# EAGLE schematic Open Lamborghino (EAGLE 9.6.2)
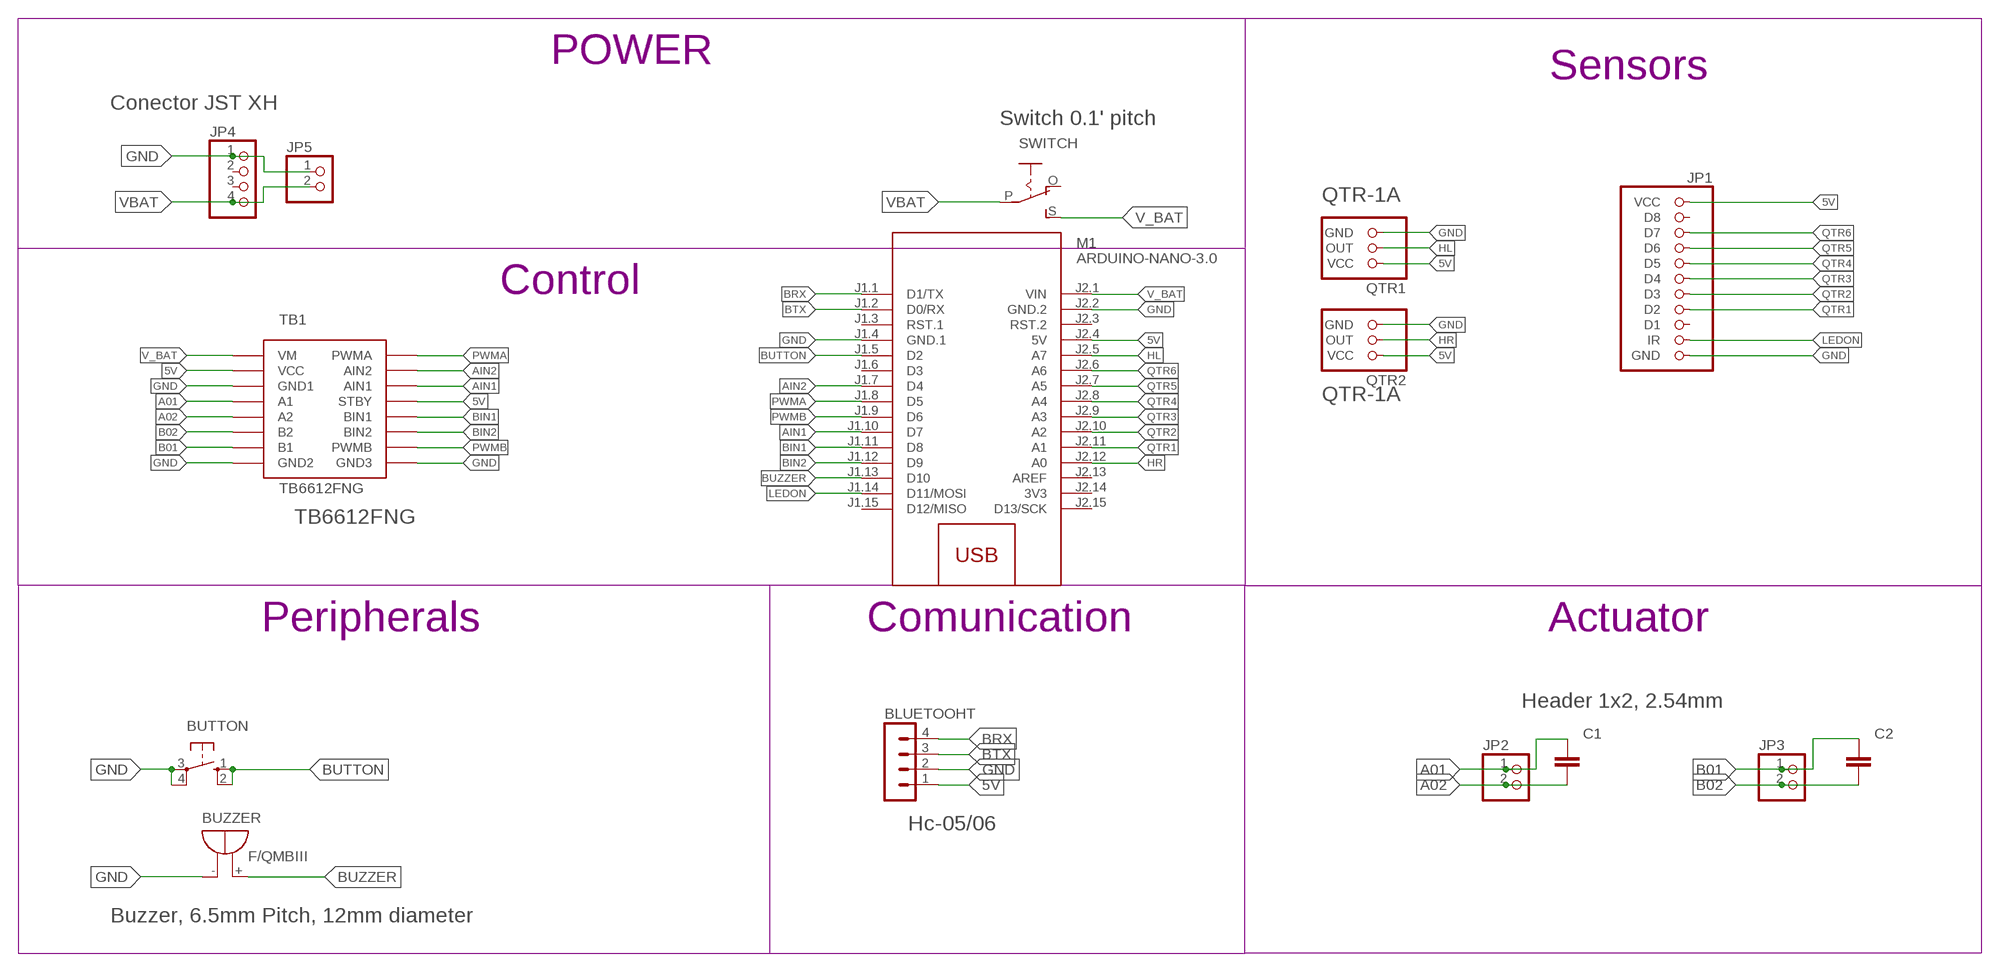
[diagram p0: schematic, sheet 1]

## Parts
BLUETOOHT  MA04-1  [MA04-1]
BUTTON  10-XX  [B3F-10XX]
BUZZER  F/QMBIII  [F/QMBIII]
C1  C_CHIP-1206(3216-METRIC)  [CAPC3216X135]
C2  C_CHIP-1206(3216-METRIC)  [CAPC3216X135]
JP1  QTR8A(CHINO)  [1X11]
JP2  PINHD-1X2  [1X02]
JP3  PINHD-1X2  [1X02]
JP4  PINHD-1X4  [1X04]
JP5  PINHD-1X2  [1X02]
M1  ARDUINO-NANO-3.0  [ARDUINO-NANO-3.0]
QTR1  QTR1(CHINO)  [QTR1]
QTR2  QTR1(CHINO)  [QTR1]
SWITCH  EG1218S  [EG1218]
TB1  TB6612FNG  [TB6612FNG]

## Nets
5V: BLUETOOHT.1 JP1.1(VCC) M1.J2.4(5V) QTR1.1(VCC) QTR2.1(VCC) TB1.STBY TB1.VCC
A01: C1.1 JP2.1 TB1.A1
A02: C1.2 JP2.2 TB1.A2
AIN1: M1.J1.10(D7) TB1.AIN1
AIN2: M1.J1.7(D4) TB1.AIN2
B01: C2.1 JP3.1 TB1.B1
B02: C2.2 JP3.2 TB1.B2
BIN1: M1.J1.11(D8) TB1.BIN1
BIN2: M1.J1.12(D9) TB1.BIN2
BRX: BLUETOOHT.4 M1.J1.1(D1/TX)
BTX: BLUETOOHT.3 M1.J1.2(D0/RX)
BUTTON: BUTTON.1(S) BUTTON.2(S1) M1.J1.5(D2)
BUZZER: BUZZER.+(-) M1.J1.13(D10)
GND: BLUETOOHT.2 BUTTON.3(P) BUTTON.4(P1) BUZZER.-(+) JP1.11(GND) JP4.1 JP5.1 M1.J1.4(GND.1) M1.J2.2(GND.2) QTR1.3(GND) QTR2.3(GND) TB1.GND1 TB1.GND2 TB1.GND3
HL: M1.J2.5(A7) QTR1.2(OUT)
HR: M1.J2.12(A0) QTR2.2(OUT)
LEDON: JP1.10(IR) M1.J1.14(D11/MOSI)
PWMA: M1.J1.8(D5) TB1.PWMA
PWMB: M1.J1.9(D6) TB1.PWMB
QTR1: JP1.8(D2) M1.J2.11(A1)
QTR2: JP1.7(D3) M1.J2.10(A2)
QTR3: JP1.6(D4) M1.J2.9(A3)
QTR4: JP1.5(D5) M1.J2.8(A4)
QTR5: JP1.4(D6) M1.J2.7(A5)
QTR6: JP1.3(D7) M1.J2.6(A6)
V_BAT: M1.J2.1(VIN) SWITCH.S TB1.VM
VBAT: JP4.4 JP5.2 SWITCH.P
Unconnected: JP1.2(D8) JP1.9(D1) JP4.2 JP4.3 M1.J1.3(RST.1) M1.J1.6(D3) M1.J1.15(D12/MISO) M1.J2.3(RST.2) M1.J2.13(AREF) M1.J2.15(D13/SCK) SWITCH.O

## Notes on the sheet
- POWER
- Sensors
- Conector JST XH
- Switch 0.1' pitch
- QTR-1A
- Control
- QTR-1A
- TB6612FNG
- Peripherals | Comunication | Actuator
- Header 1x2, 2.54mm
- Hc-05/06
- Buzzer, 6.5mm Pitch, 12mm diameter

## Power pins joined to a net without a drawn wire
3V3: M1.J2.14(3V3)

## Library data of the parts
BLUETOOHT = con-lstb:MA04-1: PIN HEADER; OC_FARNELL: unknown; OC_NEWARK: unknown
BUTTON = switch-omron:10-XX: OMRON SWITCH; MPN: B3F-1000; OC_FARNELL: 176432; OC_NEWARK: 36M3542
BUZZER = buzzer:F/QMBIII: BUZZER Source: Buerklin; OC_FARNELL: unknown; OC_NEWARK: unknown
C1 C2 = Capacitor:C: Capacitor - Generic; CATEGORY: Capacitor
JP1 = 00_personal:QTR8A(CHINO): PIN HEADER
JP2 JP3 JP5 = pinhead:PINHD-1X2: PIN HEADER
JP4 = pinhead:PINHD-1X4: PIN HEADER
M1 = diy-modules:ARDUINO-NANO-3.0: Arduino Nano 3.0 and compatible devices More details available here: https://www.arduino.cc/en/Main/ArduinoBoardNano Click here to find device on ebay.com <http://www.ebay.com/sch/arduino+nano>
QTR1 QTR2 = 00_personal:QTR1(CHINO): PIN HEADER
SWITCH = adafruit:EG1218: SLIDING SWITCH 0.1" spacing through hole, vertical SPDT slide switch http://www.ladyada.net/library/pcb/eaglelibrary.html
TB1 = TB6612FNG:TB6612FNG